# Altium project Carrier-Board-v1.0.PrjPcb (part 14 of 15)

## Sheet RGB_LEDs_INTERFACE.SchDoc
size A4; SheetNumber: 25; SheetTotal: 27
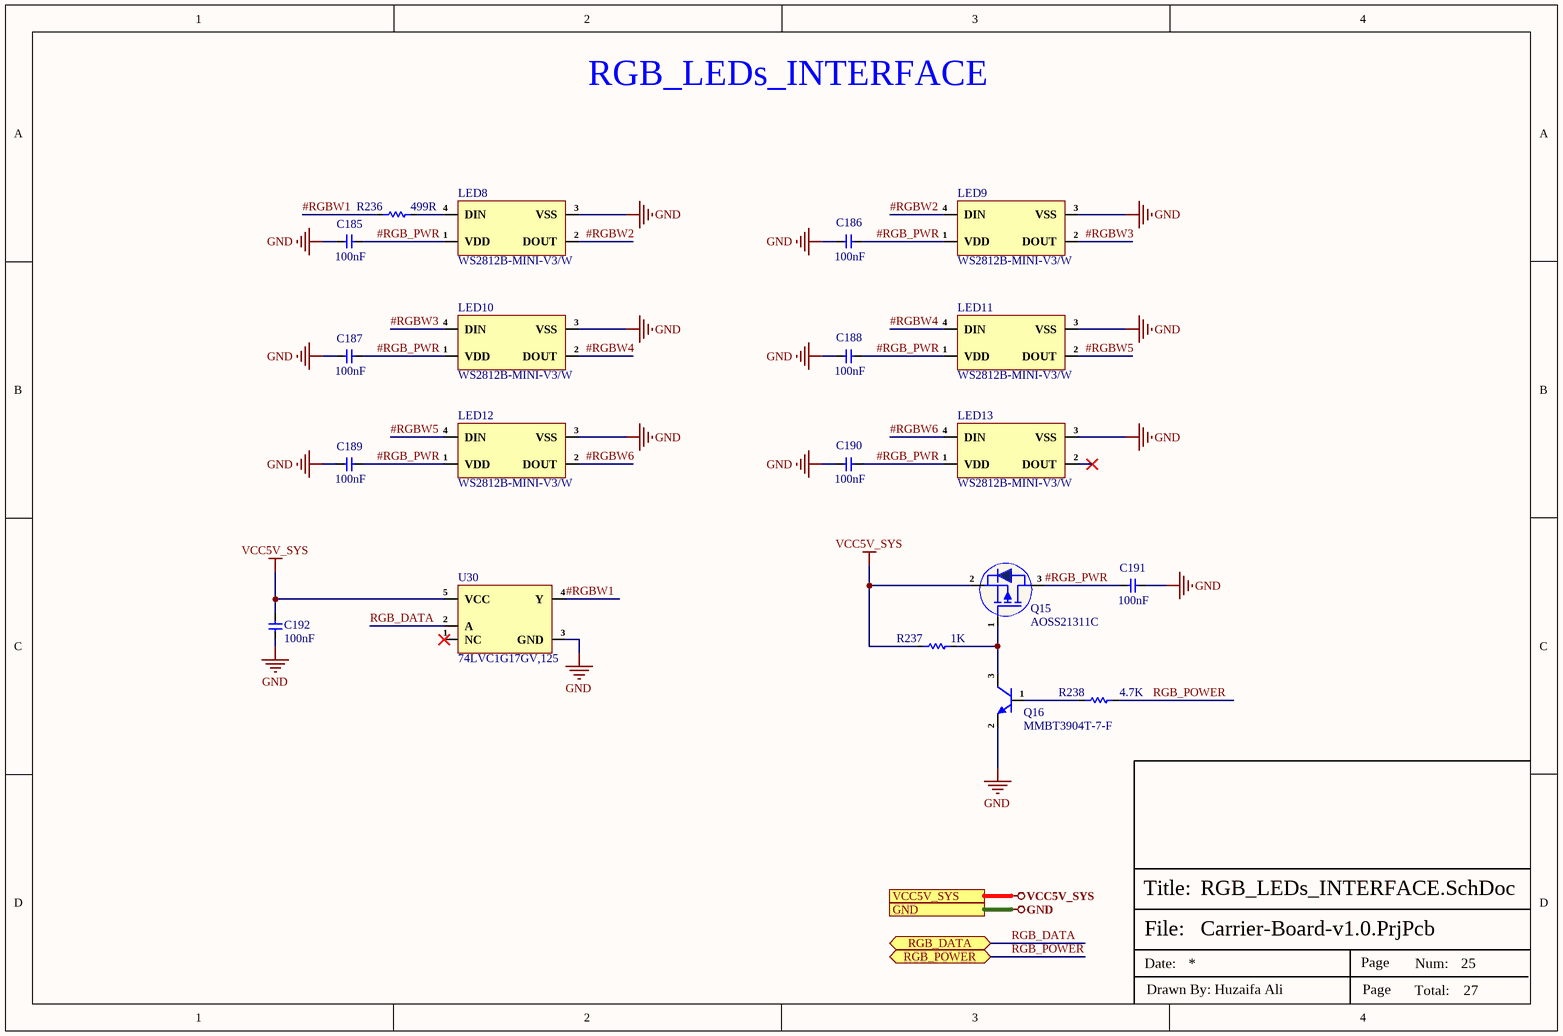
[diagram p23: RGB_LEDs_INTERFACE.SchDoc]

### Parts
C185  100nF  [Cap-0402]
C186  100nF  [Cap-0402]
C187  100nF  [Cap-0402]
C188  100nF  [Cap-0402]
C189  100nF  [Cap-0402]
C190  100nF  [Cap-0402]
C191  100nF  [Cap-0402]
C192  100nF  [Cap-0402]
LED8  WS2812B-MINI-V3/W  [SMD3535]
LED9  WS2812B-MINI-V3/W  [SMD3535]
LED10  WS2812B-MINI-V3/W  [SMD3535]
LED11  WS2812B-MINI-V3/W  [SMD3535]
LED12  WS2812B-MINI-V3/W  [SMD3535]
LED13  WS2812B-MINI-V3/W  [SMD3535]
Q15  AOSS21311C  [SOT-23]
Q16  MMBT3904T-7-F  [SOT-523]
R236  499R  [Res-0402]
R237  1K  [Res-0402]
R238  4.7K  [Res-0402]
U30  74LVC1G17GV,125  [SC-74A]

### Ports
GND (see TOP SHEET[4C], AUDIO_INTERFACE[1D], BUCK REGULATOR[3D], DEBUG_UART_INTERFACE[3D], DIGITAL IO_RELAY_SHEET[5D], DUAL_SIM_INTERFACE[3D], ETHERNET_PHY0[4D], ETHERNET_PHY1[4D], GSM_INTERFACE[2D], HDMI_INTERFACE[3D], INPUT_PROTECTION[3D], LINEAR_VOLTAGE_REG[3D], MICRO_SD_INTERFACE[3D], MIPI-DSI DISPLAY[3D], POWER SECTION[3D], PUSH BUTTONs_INTERFACE[3C], ROCKCHIP_PWR_SUPPLY[1D], ROCKCHIP_SYSTEM_CONTROL[3C], RS232_RS485_INTERFACE[3C], SENSOR_SHEET[3D], USB2.0_INTERFACE[3D], USB3.0_INTERFACE[3D], USB-C_INTERFACE[2D], WIEGAND_INTERFACE[3D], WIFI_BLUETOOTH_SHEET[4C]), RGB_DATA (bidir, see TOP SHEET[5C], ROCKCHIP_GPIO_NC PINS[2D]), RGB_POWER (bidir, see TOP SHEET[5C], ROCKCHIP_GPIO_NC PINS[2D]), VCC5V_SYS (see TOP SHEET[4C], BUCK REGULATOR[3D], DIGITAL IO_RELAY_SHEET[5D], HDMI_INTERFACE[3D], LINEAR_VOLTAGE_REG[3D], MIPI-DSI DISPLAY[3D], POWER SECTION[3D], ROCKCHIP_PWR_SUPPLY[1D], USB2.0_INTERFACE[3D], USB3.0_INTERFACE[3D], USB-C_INTERFACE[2D], WIEGAND_INTERFACE[3D])

### Nets
GND: C185.1 C186.1 C187.1 C188.1 C189.1 C190.1 C191.1 C192.1 LED8.3(VSS) LED9.3(VSS) LED10.3(VSS) LED11.3(VSS) LED12.3(VSS) LED13.3(VSS) Q16.2(E) U30.3(GND) ; port GND
VCC5V_SYS: C192.2 Q15.2(S) R237.1 U30.5(VCC) ; port VCC5V_SYS
#RGB_PWR: C185.2 C186.2 C187.2 C188.2 C189.2 C190.2 C191.2 LED8.1(VDD) LED9.1(VDD) LED10.1(VDD) LED11.1(VDD) LED12.1(VDD) LED13.1(VDD) Q15.3(D)
#RGBW1: R236.1 U30.4(Y)
#RGBW2: LED8.2(DOUT) LED9.4(DIN)
#RGBW3: LED9.2(DOUT) LED10.4(DIN)
#RGBW4: LED10.2(DOUT) LED11.4(DIN)
#RGBW5: LED11.2(DOUT) LED12.4(DIN)
#RGBW6: LED12.2(DOUT) LED13.4(DIN)
RGB_DATA: U30.2(A) ; port RGB_DATA
RGB_POWER: R238.2 ; port RGB_POWER
NetLED8_4: LED8.4(DIN) R236.2
NetQ15_1: Q15.1(G) Q16.3(C) R237.2
NetQ16_1: Q16.1(B) R238.1

Not connected (* = marked no-connect by the designer): LED13 2(DOUT)*; U30 1(NC)*

### Notes on the sheet
- RGB_LEDs_INTERFACE
- File:
- Title:
- Date:
- Page
- Num:
- Total:
- Drawn By: Huzaifa Ali

### Library data of the parts
C185-C192 = CC0402KRX5R7BB104: as C55 on sheet GSM_INTERFACE; Manufacturer Part Number: CC0402KRX5R7BB104; RoHS: Yes; Category: Ceramic Capacitors; Supplier 1: Mouser; Stock 1: 936792; Pricing 1: 1=0.10000, 10=0.02300, 50=0.02300, 100=0.01100, 1000=0.00600, 10000=0.00400 (USD); Mount: Surface Mount; Case/Package: 0402; Number of Pins: 2; Case Code (Metric): 1005; Case Code (Imperial): 0402; Min Operating Temperature: -55°C; Max Operating Temperature: 85°C; Capacitance: 100nF; Dielectric: X5R; Packaging: Tape and Reel; Voltage Rating: 16V; Package Quantity: 1; Voltage Rating (DC): 16V; Termination: SMD/SMT; Resistor Type: Ceramic; Series: CC; Construction: Flat; Length: 1mm; Width: 0.02inch; Height: 0.5mm; Thickness: 0.022inch; Depth: 0.5mm; Radiation Hardening: No; REACH SVHC: Unknown; Lead Free: Lead Free; Halogen Free: Halogen Free; RoHS Compliant: Yes; ComponentLink1URL: https://datasheet.ciiva.com/155/mlccorderingcode-155879.pdf?src-supplier=Digi-Key; ComponentLink1Description: https://datasheet.ciiva.com/155/mlccorderingcode-155879.pdf?src-supplier=Digi-Key; ComponentLink2URL: https://datasheet.ciiva.com/155/mlccorderingcode-155878.pdf?src-supplier=Digi-Key; ComponentLink2Description: https://datasheet.ciiva.com/155/mlccorderingcode-155878.pdf?src-supplier=Digi-Key; ComponentLink3URL: https://datasheet.ciiva.com/155/mlccorderingcode-155880.pdf?src-supplier=Digi-Key; ComponentLink3Description: https://datasheet.ciiva.com/155/mlccorderingcode-155880.pdf?src-supplier=Digi-Key; ComponentLink4URL: https://datasheet.ciiva.com/11464/upy-gphc-x5r-4v-to-50v-12-11464869.pdf?src-supplier=Avnet; ComponentLink4Description: https://datasheet.ciiva.com/11464/upy-gphc-x5r-4v-to-50v-12-11464869.pdf?src-supplier=Avnet; Supplier Part Number 1: 603-CC402KRX5R7BB104; LCSC Part Number: C106204
LED8-LED13 = WS2812B-MINI-V3/W: 12mA RGB SMD3535 Light Emitting Diodes (LED) ROHS; Manufacturer: Worldsemi; Item Type: RGB  LED; Manufacturer Part Number: WS2812B-MINI-V3/W; Package: SMD3535; LCSC Part Number: C527089; ComponentLink1Description: LCSC; ComponentLink1URL: https://www.lcsc.com/product-detail/Light-Emitting-Diodes-LED_Worldsemi-WS2812B-MINI-V3-W_C527089.html
Q15 = AOSS21311C: MOSFET P-CH 30V 4.3A SOT23-3; Manufacturer: Alpha & Omega Semiconductor; Supplier: Digikey; Supplier Part Number: 785-AOSS21311CCT-ND; Manufacturer Part Number: AOSS21311C; RoHS: Yes; Category: Transistors; Stock: 15013; Pricing: 1=0.44, 10=0.314, 100=0.1582, 500=0.14016, 1000=0.10908 (USD); LCSC Part Number: C3280149; Item Type: MOSFET
Q16 = MMBT3904T-7-F: TRANS NPN 40V 0.2A SOT523; Manufacturer: Diodes Zetex; Item Type: Transistor; Supplier: Future Electronics; Supplier Part Number: 4140292; Manufacturer Part Number: MMBT3904T-7-F; RoHS: Yes; Category: BJTs; Stock: 36000; Pricing: 3000=0.0261, 9000=0.0252, 15000=0.0248, 60000=0.0236, 90000=0.0229 (USD); ComponentLink1URL: https://datasheet.ciiva.com/15139/getdatasheetpartid-142850-15139485.pdf?src-supplier=Verical; ComponentLink1Description: https://datasheet.ciiva.com/15139/getdatasheetpartid-142850-15139485.pdf?src-supplier=Verical; ComponentLink2URL: https://datasheet.ciiva.com/11199/ds30270-11199009.pdf?src-supplier=Avnet; ComponentLink2Description: https://datasheet.ciiva.com/11199/ds30270-11199009.pdf?src-supplier=Avnet; ComponentLink3URL: https://datasheet.ciiva.com/17053/0900766b80e49818-17053736.pdf?src-supplier=Allied+Electronics; ComponentLink3Description: https://datasheet.ciiva.com/17053/0900766b80e49818-17053736.pdf?src-supplier=Allied+Electronics; ComponentLink4URL: https://datasheet.ciiva.com/8029/ds30270-8029717.pdf?src-supplier=Element14; ComponentLink4Description: https://datasheet.ciiva.com/8029/ds30270-8029717.pdf?src-supplier=Element14; ComponentLink5URL: https://datasheet.ciiva.com/22711/480146-22711751.pdf?src-supplier=Element14; ComponentLink5Description: https://datasheet.ciiva.com/22711/480146-22711751.pdf?src-supplier=Element14; ComponentLink6URL: https://datasheet.ciiva.com/4723/ds30270-4723401.pdf?src-supplier=Mouser; ComponentLink6Description: https://datasheet.ciiva.com/4723/ds30270-4723401.pdf?src-supplier=Mouser; ComponentLink7URL: https://datasheet.ciiva.com/6360/ds30270-6360919.pdf?src-supplier=Digikey; ComponentLink7Description: https://datasheet.ciiva.com/6360/ds30270-6360919.pdf?src-supplier=Digikey; LCSC Part Number: C239187
R236 = RC0402FR-07499RL: RES 499 OHM 1% 1/16W 0402; Manufacturer: Yageo; Power Rating: 62.5mW; Voltage Rating: 50V; Max Power Dissipation: 63mW; Temperature Coefficient: 100ppm/°C; Supplier 1: Mouser; Manufacturer Part Number: RC0402FR-07499RL; RoHS: Yes; Category: Chip SMD Resistors; Stock 1: 936879; Pricing 1: 1=0.10000, 10=0.01200, 50=0.01200, 100=0.00500, 1000=0.00300, 10000=0.00100 (USD); Case/Package: 0402; Case Code (Metric): 1005; Case Code (Imperial): 0402; Size Code: 0402; Min Operating Temperature: -55°C; Max Operating Temperature: 155°C; Resistance: 499R; Tolerance: 1%; Package Quantity: 1; Packaging: Tape and Reel; Resistor Type: Thick Film; Number of Terminations: 2; Termination: SMD/SMT; Voltage Rating (DC): 50V; Features: Moisture Resistant; Series: RC; Resistance Tolerance: 1%; Construction: Rectangular; Length: 1mm; Width: 0.02inch; Height: 0.016inch; Depth: 0.5mm; RoHS Compliant: Yes; REACH SVHC: No SVHC; Military Standard: Not; Lead Free: Lead Free; ComponentLink1URL: https://datasheet.ciiva.com/2453/pyu-r-int-thick-7-2453539.pdf?src-supplier=Digi-Key; ComponentLink1Description: https://datasheet.ciiva.com/2453/pyu-r-int-thick-7-2453539.pdf?src-supplier=Digi-Key; ComponentLink2URL: https://datasheet.ciiva.com/2453/pyu-r-int-thick-7-2453540.pdf?src-supplier=Digi-Key; ComponentLink2Description: https://datasheet.ciiva.com/2453/pyu-r-int-thick-7-2453540.pdf?src-supplier=Digi-Key; ComponentLink3URL: https://datasheet.ciiva.com/2453/pyu-r-int-thick-7-2453538.pdf?src-supplier=Digi-Key; ComponentLink3Description: https://datasheet.ciiva.com/2453/pyu-r-int-thick-7-2453538.pdf?src-supplier=Digi-Key; Supplier Part Number 1: 603-RC0402FR-07499RL; LCSC Part Number: C137970
R237 = RC0402FR-071KL: RES 1K OHM 1% 1/16W 0402; Manufacturer: Yageo; Resistance: 1kR; Temperature Coefficient: 100ppm/°C; Voltage Rating (DC): 50V; Power Rating: 62.5mW; Max Power Dissipation: 63mW; Item Type: Resistor; Supplier 1: Avnet; Manufacturer Part Number: RC0402FR-071KL; RoHS: Yes; Category: Chip SMD Resistors; Stock 1: 13030000; Pricing 1: 10000=0.00085, 20000=0.00087, 40000=0.00084, 60000=0.00083, 80000=0.00079, 100000=0.00078, 1000000=0.00076 (USD); Case/Package: 0402; Number of Pins: 2; Case Code (Imperial): 0402; Case Code (Metric): 1005; Size Code: 0402; Min Operating Temperature: -55°C; Max Operating Temperature: 155°C; Resistor Type: Thick Film; Tolerance: 1%; Packaging: Tape and Reel; Voltage Rating: 50V; Termination: SMD/SMT; Features: Moisture Resistant; Series: RC; Number of Terminations: 2; Resistance Tolerance: 1%; Construction: Rectangular; Technology: THICK FILM; Length: 1mm; Width: 0.5mm; Height: 0.32mm; Depth: 0.5mm; Reach SVHC Compliant: Yes; Lead Free: Lead Free; RoHS Compliant: Yes; Military Standard: Not; ComponentLink1URL: https://datasheet.ciiva.com/11819/0900766b80c66297-11819477.pdf?src-supplier=RSComponents; ComponentLink1Description: https://datasheet.ciiva.com/11819/0900766b80c66297-11819477.pdf?src-supplier=RSComponents; ComponentLink2URL: https://datasheet.ciiva.com/7983/1018594-7983502.pdf?src-supplier=Element14; ComponentLink2Description: https://datasheet.ciiva.com/7983/1018594-7983502.pdf?src-supplier=Element14; ComponentLink3URL: https://datasheet.ciiva.com/22747/1018594-22747513.pdf?src-supplier=Element14; ComponentLink3Description: https://datasheet.ciiva.com/22747/1018594-22747513.pdf?src-supplier=Element14; ComponentLink4URL: https://datasheet.ciiva.com/12666/pyu-rc0402-51-rohs-l-6-r-12666741.pdf?src-supplier=Mouser; ComponentLink4Description: https://datasheet.ciiva.com/12666/pyu-rc0402-51-rohs-l-6-r-12666741.pdf?src-supplier=Mouser; ComponentLink5URL: https://datasheet.ciiva.com/7849/1018594-7849869.pdf?src-supplier=Element14; ComponentLink5Description: https://datasheet.ciiva.com/7849/1018594-7849869.pdf?src-supplier=Element14; ComponentLink6URL: https://datasheet.ciiva.com/7849/1018594-7849871.pdf?src-supplier=Element14; ComponentLink6Description: https://datasheet.ciiva.com/7849/1018594-7849871.pdf?src-supplier=Element14; ComponentLink7URL: https://datasheet.ciiva.com/17063/pyu-rc0402-51-rohs-l-6-r-17063193.pdf?src-supplier=Future+Electronics; ComponentLink7Description: https://datasheet.ciiva.com/17063/pyu-rc0402-51-rohs-l-6-r-17063193.pdf?src-supplier=Future+Electronics; Supplier Part Number 1: RC0402FR-071KL; LCSC Part Number: C106235
R238 = RC0402FR-074K7L: RES 4.7K OHM 1% 1/16W 0402; Manufacturer: Yageo; Voltage Rating (DC): 50V; Power Rating: 62.5mW; Resistance: 4.7kR; Temperature Coefficient: 100ppm/°C; Max Power Dissipation: 63mW; Item Type: Resistor; Supplier 1: Avnet; Manufacturer Part Number: RC0402FR-074K7L; RoHS: Yes; Category: Chip SMD Resistors; Stock 1: 2420000; Pricing 1: 10000=0.00085 (USD); Case/Package: 0402; Number of Pins: 2; Case Code (Imperial): 0402; Case Code (Metric): 1005; Size Code: 0402; Min Operating Temperature: -55°C; Max Operating Temperature: 155°C; Tolerance: 1%; Voltage Rating: 50V; Packaging: Tape and Reel; Resistor Type: Thick Film; Termination: SMD/SMT; Features: Moisture Resistant; Series: RC; Number of Terminations: 2; Resistance Tolerance: 1%; Construction: Rectangular; Length: 1mm; Width: 0.5mm; Height: 0.32mm; Depth: 0.5mm; Height - Seated (Max): 0.016inch; RoHS Compliant: Yes; Reach SVHC Compliant: Yes; Military Standard: Not; Lead Free: Lead Free; ComponentLink1URL: https://datasheet.ciiva.com/22661/1686128-22661342.pdf?src-supplier=Element14; ComponentLink1Description: https://datasheet.ciiva.com/22661/1686128-22661342.pdf?src-supplier=Element14; ComponentLink2URL: https://datasheet.ciiva.com/7850/1018594-7850022.pdf?src-supplier=Element14; ComponentLink2Description: https://datasheet.ciiva.com/7850/1018594-7850022.pdf?src-supplier=Element14; ComponentLink3URL: https://datasheet.ciiva.com/7850/1018594-7850023.pdf?src-supplier=Element14; ComponentLink3Description: https://datasheet.ciiva.com/7850/1018594-7850023.pdf?src-supplier=Element14; ComponentLink4URL: https://datasheet.ciiva.com/15215/getdatasheetpartid-328119-15215035.pdf?src-supplier=Verical; ComponentLink4Description: https://datasheet.ciiva.com/15215/getdatasheetpartid-328119-15215035.pdf?src-supplier=Verical; Supplier Part Number 1: RC0402FR-074K7L; LCSC Part Number: C105871
U30 = 74LVC1G17GV,125: IC BUFFER SCHMITT TRIGGER 5TSOP; Manufacturer: Nexperia; Number of Channels: 1NUMBER; Supplier: Future Electronics; Supplier Part Number: 9876707; Manufacturer Part Number: 74LVC1G17GV,125; RoHS: Yes; Category: Logic Gates; Stock: 513000; Pricing: 3000=0.0334, 9000=0.0322, 30000=0.031, 60000=0.0303, 120000=0.029 (USD); Pins: 5NUMBER; Packaging: 10Packaging; RoHS Compliant: Yes; ComponentLink1URL: http://www.farnell.com/datasheets/2185283.pdf?src-supplier=Farnell; ComponentLink1Description: http://www.farnell.com/datasheets/2185283.pdf?src-supplier=Farnell; ComponentLink2URL: https://datasheet.octopart.com/74LVC1G17GV%2C125-Nexperia-datasheet-11799833.pdf?src-supplier=Farnell; ComponentLink2Description: https://datasheet.octopart.com/74LVC1G17GV%2C125-Nexperia-datasheet-11799833.pdf?src-supplier=Farnell; ComponentLink3URL: https://assets.nexperia.com/documents/data-sheet/74LVC1G17.pdf?src-supplier=Digikey; ComponentLink3Description: https://assets.nexperia.com/documents/data-sheet/74LVC1G17.pdf?src-supplier=Digikey; ComponentLink4URL: https://datasheet.octopart.com/74LVC1G17GV%2C125-Nexperia-datasheet-116120530.pdf?src-supplier=Future+Electronics; ComponentLink4Description: https://datasheet.octopart.com/74LVC1G17GV%2C125-Nexperia-datasheet-116120530.pdf?src-supplier=Future+Electronics; ComponentLink5URL: https://datasheet.octopart.com/74LVC1G17GV%2C125-Nexperia-datasheet-73818103.pdf?src-supplier=Element14; ComponentLink5Description: https://datasheet.octopart.com/74LVC1G17GV%2C125-Nexperia-datasheet-73818103.pdf?src-supplier=Element14; ComponentLink6URL: https://datasheet.octopart.com/74LVC1G17GV%2C125-NXP-Semiconductors-datasheet-13026859.pdf?src-supplier=Newark; ComponentLink6Description: https://datasheet.octopart.com/74LVC1G17GV%2C125-NXP-Semiconductors-datasheet-13026859.pdf?src-supplier=Newark; LCSC Part Number: C6076; Item Type: IC

## Sheet PUSH BUTTONs_INTERFACE.SchDoc
size A4; SheetNumber: 24; SheetTotal: 27
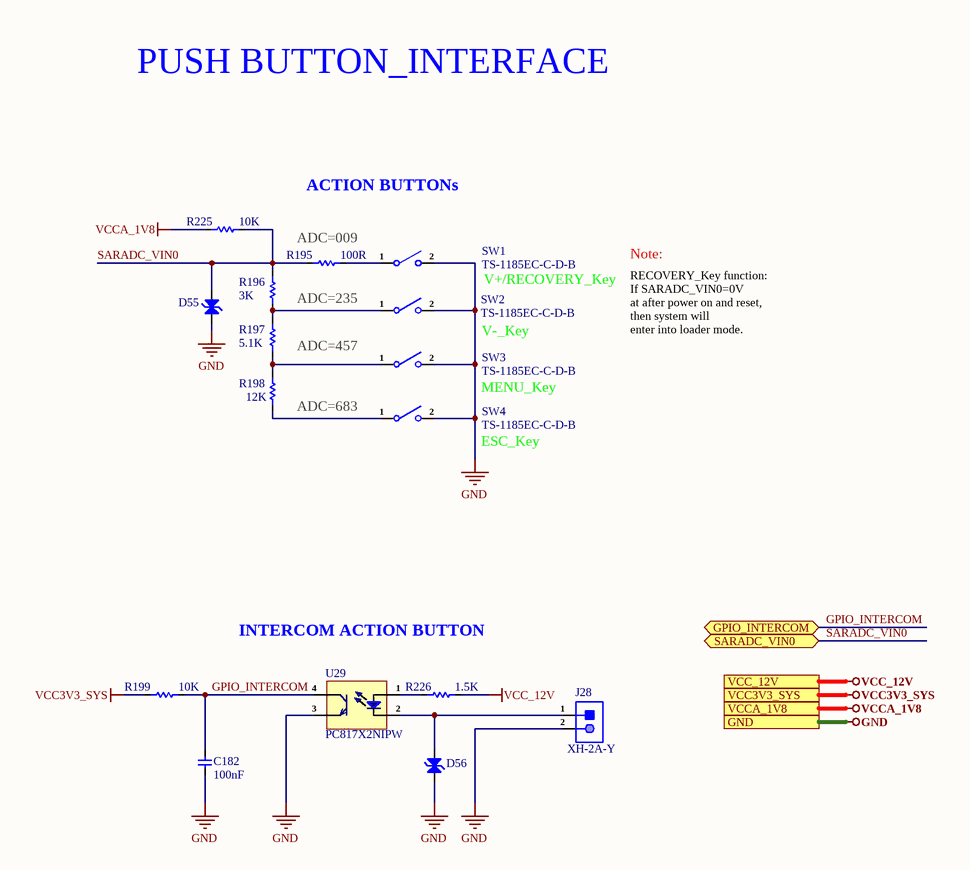
[diagram p24: PUSH BUTTONs_INTERFACE.SchDoc]

### Parts
C182  100nF  [Cap-0402]
D55  ESD5451N  [DFN1006-2L (Bi-Directional)]  (value not drawn)
D56  ESD5451N  [DFN1006-2L (Bi-Directional)]  (value not drawn)
J28  XH-2A-Y  [XH-2A-Y]
R195  100R  [Res-0402]
R196  3K  [Res-0402]
R197  5.1K  [Res-0402]
R198  12K  [Res-0402]
R199  10K  [Res-0402]
R225  10K  [Res-0402]
R226  1.5K  [Res-0402]
SW1  TS-1185EC-C-D-B  [TS-1185EC-C-D-B_]
SW2  TS-1185EC-C-D-B  [TS-1185EC-C-D-B_]
SW3  TS-1185EC-C-D-B  [TS-1185EC-C-D-B_]
SW4  TS-1185EC-C-D-B  [TS-1185EC-C-D-B_]
U29  PC817X2NIPW  [PC817X2NIPW]

### Ports
GND (see TOP SHEET[4D], AUDIO_INTERFACE[1D], BUCK REGULATOR[3D], DEBUG_UART_INTERFACE[3D], DIGITAL IO_RELAY_SHEET[5D], DUAL_SIM_INTERFACE[3D], ETHERNET_PHY0[4D], ETHERNET_PHY1[4D], GSM_INTERFACE[2D], HDMI_INTERFACE[3D], INPUT_PROTECTION[3D], LINEAR_VOLTAGE_REG[3D], MICRO_SD_INTERFACE[3D], MIPI-DSI DISPLAY[3D], POWER SECTION[3D], RGB_LEDs_INTERFACE[3D], ROCKCHIP_PWR_SUPPLY[1D], ROCKCHIP_SYSTEM_CONTROL[3C], RS232_RS485_INTERFACE[3C], SENSOR_SHEET[3D], USB2.0_INTERFACE[3D], USB3.0_INTERFACE[3D], USB-C_INTERFACE[2D], WIEGAND_INTERFACE[3D], WIFI_BLUETOOTH_SHEET[4C]), GPIO_INTERCOM (bidir, see TOP SHEET[5D], ROCKCHIP_GPIO_NC PINS[3D]), SARADC_VIN0 (bidir, see TOP SHEET[5D], ROCKCHIP_GPIO_NC PINS[3C]), VCC3V3_SYS (see TOP SHEET[4D], AUDIO_INTERFACE[1D], BUCK REGULATOR[3D], DEBUG_UART_INTERFACE[3D], DIGITAL IO_RELAY_SHEET[5D], ETHERNET_PHY0[4D], ETHERNET_PHY1[4D], GSM_INTERFACE[2D], HDMI_INTERFACE[3D], LINEAR_VOLTAGE_REG[3D], MIPI-DSI DISPLAY[3D], POWER SECTION[3D], ROCKCHIP_PWR_SUPPLY[1D], ROCKCHIP_SYSTEM_CONTROL[3C], RS232_RS485_INTERFACE[3C], SENSOR_SHEET[3D], USB-C_INTERFACE[2D], WIEGAND_INTERFACE[3D], WIFI_BLUETOOTH_SHEET[4C]), VCC_12V (see TOP SHEET[4D], AUDIO_INTERFACE[1D], BUCK REGULATOR[3D], INPUT_PROTECTION[3D], POWER SECTION[3D], WIEGAND_INTERFACE[3D]), VCCA_1V8 (see TOP SHEET[4D], ROCKCHIP_PWR_SUPPLY[1D], ROCKCHIP_SYSTEM_CONTROL[3C])

### Nets
GND: C182.1 D55.1(K) D56.1(K) J28.2 SW1.2 SW2.2 SW3.2 SW4.2 U29.3(E) ; port GND
VCC3V3_SYS: R199.2 ; port VCC3V3_SYS
VCC_12V: R226.2 ; port VCC_12V
VCCA_1V8: R225.2 ; port VCCA_1V8
GPIO_INTERCOM: C182.2 R199.1 U29.4(C) ; port GPIO_INTERCOM
SARADC_VIN0: D55.2(K) R195.1 R196.2 R225.1 ; port SARADC_VIN0
NetD56_2: D56.2(K) J28.1 U29.2(Ca)
NetR195_2: R195.2 SW1.1
NetR196_1: R196.1 R197.2 SW2.1
NetR197_1: R197.1 R198.2 SW3.1
NetR198_1: R198.1 SW4.1
NetR226_1: R226.1 U29.1(An)

### Notes on the sheet
- PUSH BUTTON_INTERFACE
- ACTION BUTTONs
- (near R195) ADC=009
- ADC=235
- V+/RECOVERY_Key
- Note:
- ADC=457
- V-_Key
- RECOVERY_Key function:
  If SARADC_VIN0=0V
  at after power on and reset,
  then system will
  enter into loader mode.
- ADC=683
- ESC_Key
- MENU_Key
- INTERCOM ACTION BUTTON
- File:
- Title:
- Date:
- Page
- Num:
- Total:
- Drawn By: Huzaifa Ali

### Library data of the parts
C182 = CC0402KRX5R7BB104: CAP CER 0.1UF 16V X5R 0402; Manufacturer: Yageo; Tolerance: 10%; Manufacturer Part Number: CC0402KRX5R7BB104; RoHS: Yes; Category: Ceramic Capacitors; Supplier 1: Mouser; Stock 1: 936792; Pricing 1: 1=0.10000, 10=0.02300, 50=0.02300, 100=0.01100, 1000=0.00600, 10000=0.00400 (USD); Mount: Surface Mount; Case/Package: 0402; Number of Pins: 2; Case Code (Metric): 1005; Case Code (Imperial): 0402; Min Operating Temperature: -55°C; Max Operating Temperature: 85°C; Capacitance: 100nF; Dielectric: X5R; Packaging: Tape and Reel; Voltage Rating: 16V; Package Quantity: 1; Voltage Rating (DC): 16V; Termination: SMD/SMT; Resistor Type: Ceramic; Series: CC; Construction: Flat; Length: 1mm; Width: 0.02inch; Height: 0.5mm; Thickness: 0.022inch; Depth: 0.5mm; Radiation Hardening: No; REACH SVHC: Unknown; Lead Free: Lead Free; Halogen Free: Halogen Free; RoHS Compliant: Yes; ComponentLink1URL: https://datasheet.ciiva.com/155/mlccorderingcode-155879.pdf?src-supplier=Digi-Key; ComponentLink1Description: https://datasheet.ciiva.com/155/mlccorderingcode-155879.pdf?src-supplier=Digi-Key; ComponentLink2URL: https://datasheet.ciiva.com/155/mlccorderingcode-155878.pdf?src-supplier=Digi-Key; ComponentLink2Description: https://datasheet.ciiva.com/155/mlccorderingcode-155878.pdf?src-supplier=Digi-Key; ComponentLink3URL: https://datasheet.ciiva.com/155/mlccorderingcode-155880.pdf?src-supplier=Digi-Key; ComponentLink3Description: https://datasheet.ciiva.com/155/mlccorderingcode-155880.pdf?src-supplier=Digi-Key; ComponentLink4URL: https://datasheet.ciiva.com/11464/upy-gphc-x5r-4v-to-50v-12-11464869.pdf?src-supplier=Avnet; ComponentLink4Description: https://datasheet.ciiva.com/11464/upy-gphc-x5r-4v-to-50v-12-11464869.pdf?src-supplier=Avnet; Supplier Part Number 1: 603-CC402KRX5R7BB104; LCSC Part Number: C106204
D55 D56 = ESD5451N: DFN1006-2(0402) ESD Protection Devices ROHS; Manufacturer: TECH PUBLIC; Manufacturer Part Number: ESD5451N; Footprint: DFN1006-2(0402); ComponentLink1Description: LCSC; ComponentLink1URL: https://www.lcsc.com/product-detail/span-style-background-color-ff0-ESD-span-Protection-Devices_TECH-PUBLIC-ESD5451N_C2936977.html; LCSC Part Number: C2936977
J28 = XH-2A-Y: 1x2P 2P XH 1 Tin 2.5mm 2 -25℃~+85℃ Brass 3A Straight Plugin,P=2.5mm Wire To Board Connector ROHS; Manufacturer: HCTL; Manufacturer Part Number: XH-2A-Y; Package: Plugin,P=2.5mm; LCSC Part Number: C2908595; Item Type: Wire To Board Connector; ComponentLink1Description: LCSC; ComponentLink1URL: https://www.lcsc.com/product-detail/Wire-To-Board-Connector_HCTL-XH-2A-Y_C2908595.html
R195 = RC0402FR-07100RL: RES 100 OHM 1% 1/16W 0402; Manufacturer: Yageo; Power Rating: 62.5mW; Voltage Rating: 50V; Temperature Coefficient: 100ppm/°C; Max Power Dissipation: 63mW; Item Type: Resistor; Supplier 1: Mouser; Manufacturer Part Number: RC0402FR-07100RL; RoHS: Yes; Category: Chip SMD Resistors; Stock 1: 699545; Pricing 1: 1=0.10000, 10=0.01200, 50=0.01200, 100=0.00500, 1000=0.00300, 2500=0.00200, 10000=0.00100 (USD); Case/Package: 0402; Number of Pins: 2; Case Code (Imperial): 0402; Case Code (Metric): 1005; Size Code: 0402; Min Operating Temperature: -55°C; Max Operating Temperature: 155°C; Tolerance: 1%; Voltage Rating (DC): 50V; Resistance: 100R; Packaging: Tape and Reel; Termination: SMD/SMT; Resistor Type: Thick Film; Features: Moisture Resistant; Series: RC; Number of Terminations: 2; Resistance Tolerance: 1%; Construction: Rectangular; Technology: THICK FILM; Length: 1mm; Width: 0.5mm; Height: 0.32mm; Depth: 0.5mm; RoHS Compliant: Yes; REACH SVHC: No SVHC; Military Standard: Not; Lead Free: Lead Free; ComponentLink1URL: https://datasheet.ciiva.com/11808/0900766b80c66297-11808765.pdf?src-supplier=RSComponents; ComponentLink1Description: https://datasheet.ciiva.com/11808/0900766b80c66297-11808765.pdf?src-supplier=RSComponents; ComponentLink2URL: https://datasheet.ciiva.com/7849/1784430-7849810.pdf?src-supplier=Element14; ComponentLink2Description: https://datasheet.ciiva.com/7849/1784430-7849810.pdf?src-supplier=Element14; ComponentLink3URL: https://datasheet.ciiva.com/28367/1018594-28367226.pdf?src-supplier=Element14; ComponentLink3Description: https://datasheet.ciiva.com/28367/1018594-28367226.pdf?src-supplier=Element14; ComponentLink4URL: https://datasheet.ciiva.com/22747/1018594-22747511.pdf?src-supplier=Element14; ComponentLink4Description: https://datasheet.ciiva.com/22747/1018594-22747511.pdf?src-supplier=Element14; ComponentLink5URL: https://datasheet.ciiva.com/12667/pyu-rc0402-51-rohs-l-6-r-12667957.pdf?src-supplier=Mouser; ComponentLink5Description: https://datasheet.ciiva.com/12667/pyu-rc0402-51-rohs-l-6-r-12667957.pdf?src-supplier=Mouser; ComponentLink6URL: https://datasheet.ciiva.com/15189/getdatasheetpartid-329466-15189335.pdf?src-supplier=Verical; ComponentLink6Description: https://datasheet.ciiva.com/15189/getdatasheetpartid-329466-15189335.pdf?src-supplier=Verical; ComponentLink7URL: https://datasheet.ciiva.com/16740/pyu-rc0402-51-rohs-l-6-r-16740566.pdf?src-supplier=Future+Electronics; ComponentLink7Description: https://datasheet.ciiva.com/16740/pyu-rc0402-51-rohs-l-6-r-16740566.pdf?src-supplier=Future+Electronics; Supplier Part Number 1: 603-RC0402FR-07100RL; LCSC Part Number: C106232
R196 = RC0402FR-073KL: RES 3K OHM 1% 1/16W 0402; Manufacturer: Yageo; Value: 3kR; Power Rating: 63mW; Voltage Rating: 50V; Temperature Coefficient: 100ppm/°C; Item Type: Resistor; Supplier: Digikey; Supplier Part Number: 311-3KLRCT-ND; Manufacturer Part Number: RC0402FR-073KL; RoHS: Yes; Category: Chip SMD Resistors; Stock: 7013; Pricing: 1=0.1, 10=0.015, 50=0.0088, 100=0.0073, 500=0.00488, 1000=0.00417, 5000=0.00297 (USD); Case/Package: 0402; Case Code (Metric): 1005; Case Code (Imperial): 0402; Min Operating Temperature: -55°C; Max Operating Temperature: 155°C; Tolerance: 1%; Package Quantity: 1; Packaging: Tape and Reel; Resistor Type: Thick Film; Number of Terminations: 2; Termination: SMD/SMT; Max Power Dissipation: 63mW; Features: Moisture Resistant; Series: RC; Resistance Tolerance: 1%; Construction: Rectangular; Voltage Rating (DC): 50V; Length: 0.039inch; Width: 0.02inch; Height: 0.016inch; Depth: 0.5mm; Military Standard: Not; RoHS Compliant: Yes; Reach SVHC Compliant: Unknown; Lead Free: 5697LeadFree; ComponentLink1URL: https://datasheet.ciiva.com/2553/pyu-r-int-thick-7-2553254.pdf?src-supplier=Digikey; ComponentLink1Description: https://datasheet.ciiva.com/2553/pyu-r-int-thick-7-2553254.pdf?src-supplier=Digikey; ComponentLink2URL: https://datasheet.ciiva.com/7849/1018594-7849992.pdf?src-supplier=Element14; ComponentLink2Description: https://datasheet.ciiva.com/7849/1018594-7849992.pdf?src-supplier=Element14; ComponentLink3URL: https://datasheet.ciiva.com/7849/1018594-7849991.pdf?src-supplier=Element14; ComponentLink3Description: https://datasheet.ciiva.com/7849/1018594-7849991.pdf?src-supplier=Element14; ComponentLink4URL: https://datasheet.ciiva.com/2553/pyu-r-int-thick-7-2553255.pdf?src-supplier=Digikey; ComponentLink4Description: https://datasheet.ciiva.com/2553/pyu-r-int-thick-7-2553255.pdf?src-supplier=Digikey; ComponentLink5URL: https://datasheet.ciiva.com/2553/pyu-r-int-thick-7-2553256.pdf?src-supplier=Digikey; ComponentLink5Description: https://datasheet.ciiva.com/2553/pyu-r-int-thick-7-2553256.pdf?src-supplier=Digikey; ComponentLink6URL: https://datasheet.ciiva.com/12666/pyu-rc0402-51-rohs-l-6-r-12666952.pdf?src-supplier=Mouser; ComponentLink6Description: https://datasheet.ciiva.com/12666/pyu-rc0402-51-rohs-l-6-r-12666952.pdf?src-supplier=Mouser; LCSC Part Number: C137987
R197 = RC0402FR-075K1L: RES 5.1K OHM 1% 1/16W 0402; Manufacturer: Yageo; Power Rating: 63mW; Resistance: 5.1kR; Temperature Coefficient: 100ppm/°C; Voltage Rating: 50V; Item Type: Resistor; Supplier 1: Avnet; Manufacturer Part Number: RC0402FR-075K1L; RoHS: Yes; Category: Chip SMD Resistors; Stock 1: 65000; Pricing 1: 10000=0.00085 (USD); Case/Package: 0402; Case Code (Metric): 1005; Case Code (Imperial): 0402; Min Operating Temperature: -55°C; Max Operating Temperature: 155°C; Tolerance: 1%; Technology: THICK FILM; Packaging: Tape and Reel; Package Quantity: 1; Resistor Type: Thick Film; Number of Terminations: 2; Termination: SMD/SMT; Max Power Dissipation: 63mW; Voltage Rating (DC): 50V; Working Voltage: 50V; Features: Moisture Resistant; Series: RC; Resistance Tolerance: 1%; Construction: Rectangular; Length: 1mm; Width: 0.02inch; Height: 0.016inch; Depth: 0.5mm; RoHS Compliant: Yes; Military Standard: Not; Lead Free: Lead Free; ComponentLink1URL: https://datasheet.ciiva.com/7983/1018594-7983519.pdf?src-supplier=Element14; ComponentLink1Description: https://datasheet.ciiva.com/7983/1018594-7983519.pdf?src-supplier=Element14; ComponentLink2URL: https://datasheet.ciiva.com/46394/1018594-46394936.pdf?src-supplier=Element14; ComponentLink2Description: https://datasheet.ciiva.com/46394/1018594-46394936.pdf?src-supplier=Element14; ComponentLink3URL: https://datasheet.ciiva.com/2453/pyu-r-int-thick-7-2453401.pdf?src-supplier=Digi-Key; ComponentLink3Description: https://datasheet.ciiva.com/2453/pyu-r-int-thick-7-2453401.pdf?src-supplier=Digi-Key; ComponentLink4URL: https://datasheet.ciiva.com/2453/pyu-r-int-thick-7-2453402.pdf?src-supplier=Digi-Key; ComponentLink4Description: https://datasheet.ciiva.com/2453/pyu-r-int-thick-7-2453402.pdf?src-supplier=Digi-Key; ComponentLink5URL: https://datasheet.ciiva.com/2453/pyu-r-int-thick-7-2453400.pdf?src-supplier=Digi-Key; ComponentLink5Description: https://datasheet.ciiva.com/2453/pyu-r-int-thick-7-2453400.pdf?src-supplier=Digi-Key; ComponentLink6URL: https://datasheet.ciiva.com/12558/pyu-rc0402-51-rohs-l-6-r-8721-12558460.pdf?src-supplier=Mouser; ComponentLink6Description: https://datasheet.ciiva.com/12558/pyu-rc0402-51-rohs-l-6-r-8721-12558460.pdf?src-supplier=Mouser; ComponentLink7URL: https://datasheet.ciiva.com/16744/pyu-rc0402-51-rohs-l-6-r-16744283.pdf?src-supplier=Future+Electronics; ComponentLink7Description: https://datasheet.ciiva.com/16744/pyu-rc0402-51-rohs-l-6-r-16744283.pdf?src-supplier=Future+Electronics; ComponentLink8URL: https://datasheet.ciiva.com/15189/getdatasheetpartid-323636-15189493.pdf?src-supplier=Verical; ComponentLink8Description: https://datasheet.ciiva.com/15189/getdatasheetpartid-323636-15189493.pdf?src-supplier=Verical; Supplier Part Number 1: RC0402FR-075K1L; LCSC Part Number: C105872
R198 = RC0402FR-0712KL: RES 12K OHM 1% 1/16W 0402; Manufacturer: Yageo; Temperature Coefficient: 100ppm/°C; Max Power Dissipation: 63mW; Value: 12kR; Power Rating: 62.5mW; Voltage Rating: 50V; Manufacturer Part Number: RC0402FR-0712KL; Case/Package: 0402; Min Operating Temperature: -55°C; Max Operating Temperature: 155°C; Tolerance: 1%; Packaging: Tape and Reel; Resistor Type: Thick Film; Number of Terminations: 2; Features: Moisture Resistant; Length: 1mm; Width: 0.02inch; ComponentLink1URL: https://datasheet.ciiva.com/46412/1018594-46412831.pdf?src-supplier=Element14; ComponentLink1Description: https://datasheet.ciiva.com/46412/1018594-46412831.pdf?src-supplier=Element14; ComponentLink2URL: https://datasheet.ciiva.com/2453/pyu-r-int-thick-7-2453380.pdf?src-supplier=Digikey; ComponentLink2Description: https://datasheet.ciiva.com/2453/pyu-r-int-thick-7-2453380.pdf?src-supplier=Digikey; ComponentLink3URL: https://datasheet.ciiva.com/2453/pyu-r-int-thick-7-2453381.pdf?src-supplier=Digikey; ComponentLink3Description: https://datasheet.ciiva.com/2453/pyu-r-int-thick-7-2453381.pdf?src-supplier=Digikey; Package Quantity: 1; Height: 0.016inch; Supplier: Future Electronics; Supplier Part Number: 5655139; RoHS: Yes; Category: Chip SMD Resistors; Stock: 2030000; Pricing: 10000=0.0011, 100000=0.0011, 300000=0.001, 750000=0.001, 2000000=0.0009 (USD); Case Code (Metric): 1005; Case Code (Imperial): 0402; Weight: 2.3E-05oz; Termination: SMD/SMT; Series: RC; Resistance Tolerance: 1%; Construction: Rectangular; Voltage Rating (AC): 50V; Depth: 0.5mm; Reach SVHC Compliant: No; Military Standard: Not; RoHS Compliant: Yes; Lead Free: 5697LeadFree; ComponentLink4URL: https://datasheet.ciiva.com/2453/pyu-r-int-thick-7-2453379.pdf?src-supplier=Digikey; ComponentLink4Description: https://datasheet.ciiva.com/2453/pyu-r-int-thick-7-2453379.pdf?src-supplier=Digikey; ComponentLink5URL: https://datasheet.ciiva.com/12577/pyu-rc0402-51-rohs-l-6-r-12577269.pdf?src-supplier=Mouser; ComponentLink5Description: https://datasheet.ciiva.com/12577/pyu-rc0402-51-rohs-l-6-r-12577269.pdf?src-supplier=Mouser; ComponentLink6URL: https://datasheet.ciiva.com/7849/1018594-7849833.pdf?src-supplier=Element14; ComponentLink6Description: https://datasheet.ciiva.com/7849/1018594-7849833.pdf?src-supplier=Element14; ComponentLink7URL: https://datasheet.ciiva.com/7849/1018594-7849832.pdf?src-supplier=Element14; ComponentLink7Description: https://datasheet.ciiva.com/7849/1018594-7849832.pdf?src-supplier=Element14; ComponentLink8URL: https://datasheet.ciiva.com/16744/pyu-rc0402-51-rohs-l-6-r-16744492.pdf?src-supplier=Future+Electronics; ComponentLink8Description: https://datasheet.ciiva.com/16744/pyu-rc0402-51-rohs-l-6-r-16744492.pdf?src-supplier=Future+Electronics
R199 R225 = RC0402FR-0710KL: RES 10K OHM 1% 1/16W 0402; Manufacturer: Yageo; Max Power Dissipation: 63mW; Temperature Coefficient: 100ppm/°C; Resistance: 10kR; Voltage Rating (DC): 50V; Power Rating: 62.5mW; Item Type: Resistor; Manufacturer Part Number: RC0402FR-0710KL; RoHS: Yes; Category: Chip SMD Resistors; Case/Package: 0402; Case Code (Imperial): 0402; Case Code (Metric): 1005; Min Operating Temperature: -55°C; Max Operating Temperature: 155°C; Features: Moisture Resistant; Packaging: Tape and Reel; Tolerance: 1%; Number of Terminations: 2; Series: RC; RoHS Compliant: Yes; ComponentLink1URL: https://datasheet.ciiva.com/7660/38568-7660787.pdf?src-supplier=Element14; ComponentLink1Description: https://datasheet.ciiva.com/7660/38568-7660787.pdf?src-supplier=Element14; Supplier 1: Mouser; Stock 1: 18648329; Pricing 1: 1=0.10000, 10=0.01400, 50=0.01400, 100=0.00500, 1000=0.00300, 10000=0.00200 (USD); Number of Pins: 2; Resistor Type: Thick Film; Voltage Rating: 50V; Termination: SMD/SMT; Resistance Tolerance: 1%; Construction: Rectangular; Length: 1mm; Width: 0.5mm; Height: 0.32mm; Depth: 0.5mm; Lead Pitch: 0.2mm; REACH SVHC: No SVHC; Lead Free: Lead Free; Military Standard: Not; ComponentLink2URL: https://datasheet.ciiva.com/7849/1686128-7849814.pdf?src-supplier=Element14; ComponentLink2Description: https://datasheet.ciiva.com/7849/1686128-7849814.pdf?src-supplier=Element14; ComponentLink3URL: https://datasheet.ciiva.com/7983/1018594-7983486.pdf?src-supplier=Element14; ComponentLink3Description: https://datasheet.ciiva.com/7983/1018594-7983486.pdf?src-supplier=Element14; ComponentLink4URL: https://datasheet.ciiva.com/22747/1018594-22747512.pdf?src-supplier=Element14; ComponentLink4Description: https://datasheet.ciiva.com/22747/1018594-22747512.pdf?src-supplier=Element14; ComponentLink5URL: https://datasheet.ciiva.com/12667/pyu-rc0402-51-rohs-l-6-r-12667067.pdf?src-supplier=Mouser; ComponentLink5Description: https://datasheet.ciiva.com/12667/pyu-rc0402-51-rohs-l-6-r-12667067.pdf?src-supplier=Mouser; ComponentLink6URL: https://datasheet.ciiva.com/7849/1784430-7849813.pdf?src-supplier=Element14; ComponentLink6Description: https://datasheet.ciiva.com/7849/1784430-7849813.pdf?src-supplier=Element14; Supplier Part Number 1: 603-RC0402FR-0710KL; LCSC Part Number: C60490; Working Voltage: 50V; ComponentLink7URL: https://datasheet.ciiva.com/7849/1784430-7849815.pdf?src-supplier=Element14; ComponentLink7Description: https://datasheet.ciiva.com/7849/1784430-7849815.pdf?src-supplier=Element14
R226 = RC0402FR-071K5L: RES 1.5K OHM 1% 1/16W 0402; Manufacturer: Yageo; Resistance: 1.5kR; Power Rating: 62.5mW; Voltage Rating: 50V; Temperature Coefficient: 100ppm/°C; Max Power Dissipation: 63mW; Supplier 1: Digi-Key; Manufacturer Part Number: RC0402FR-071K5L; RoHS: Yes; Category: Chip SMD Resistors; Stock 1: 2832947; Pricing 1: 1=0.10000, 10=0.01500, 100=0.00610, 1000=0.00275, 2500=0.00239, 5000=0.00197 (USD); Case/Package: 0402; Case Code (Metric): 1005; Case Code (Imperial): 0402; Size Code: 0402; Min Operating Temperature: -55°C; Max Operating Temperature: 155°C; Resistor Type: Thick Film; Package Quantity: 1; Tolerance: 1%; Packaging: Tape and Reel; Number of Terminations: 2; Termination: SMD/SMT; Features: Moisture Resistant; Series: RC; Resistance Tolerance: 1%; Construction: Rectangular; Technology: THICK FILM; Length: 1mm; Width: 0.02inch; Height: 0.016inch; Depth: 0.5mm; RoHS Compliant: Yes; REACH SVHC: No SVHC; Military Standard: Not; Lead Free: Lead Free; ComponentLink1URL: https://datasheet.ciiva.com/11808/0900766b80c66297-11808238.pdf?src-supplier=RSComponents; ComponentLink1Description: https://datasheet.ciiva.com/11808/0900766b80c66297-11808238.pdf?src-supplier=RSComponents; ComponentLink2URL: https://datasheet.ciiva.com/46394/1018594-46394950.pdf?src-supplier=Element14; ComponentLink2Description: https://datasheet.ciiva.com/46394/1018594-46394950.pdf?src-supplier=Element14; ComponentLink3URL: https://datasheet.ciiva.com/2453/pyu-r-int-thick-7-2453440.pdf?src-supplier=Digi-Key; ComponentLink3Description: https://datasheet.ciiva.com/2453/pyu-r-int-thick-7-2453440.pdf?src-supplier=Digi-Key; ComponentLink4URL: https://datasheet.ciiva.com/2453/pyu-r-int-thick-7-2453441.pdf?src-supplier=Digi-Key; ComponentLink4Description: https://datasheet.ciiva.com/2453/pyu-r-int-thick-7-2453441.pdf?src-supplier=Digi-Key; ComponentLink5URL: https://datasheet.ciiva.com/2453/pyu-r-int-thick-7-2453439.pdf?src-supplier=Digi-Key; ComponentLink5Description: https://datasheet.ciiva.com/2453/pyu-r-int-thick-7-2453439.pdf?src-supplier=Digi-Key; ComponentLink6URL: https://datasheet.ciiva.com/12558/pyu-rc0402-51-rohs-l-6-r-8721-12558542.pdf?src-supplier=Mouser; ComponentLink6Description: https://datasheet.ciiva.com/12558/pyu-rc0402-51-rohs-l-6-r-8721-12558542.pdf?src-supplier=Mouser; ComponentLink7URL: https://datasheet.ciiva.com/7849/1018594-7849863.pdf?src-supplier=Element14; ComponentLink7Description: https://datasheet.ciiva.com/7849/1018594-7849863.pdf?src-supplier=Element14; ComponentLink8URL: https://datasheet.ciiva.com/7849/1018594-7849864.pdf?src-supplier=Element14; ComponentLink8Description: https://datasheet.ciiva.com/7849/1018594-7849864.pdf?src-supplier=Element14; ComponentLink9URL: https://datasheet.ciiva.com/15189/getdatasheetpartid-323992-15189370.pdf?src-supplier=Verical; ComponentLink9Description: https://datasheet.ciiva.com/15189/getdatasheetpartid-323992-15189370.pdf?src-supplier=Verical; Supplier Part Number 1: 311-1.50KLRCT-ND; LCSC Part Number: C114759
SW1-SW4 = TS-1185EC-C-D-B: 3mm 2mm Round Button 50mA Top3.65mm SPST 12V SMD Tactile Switches; Manufacturer: XKB; Manufacturer Part Number: TS-1185EC-C-D-B; Footprint: Custom; ComponentLink1Description: LCSC; ComponentLink1URL: https://lcsc.com/product-detail/Tactile-Switches_XKB-Connectivity-TS-1185EC-C-D-B_C318893.html; LCSC Part Number: C318893
U29 = PC817X2NIPW: Optoisolator Output Channel 4-SMD; Manufacturer: Sharp; Item Type: IC; Supplier: Mouser; Supplier Part Number: 852-PC817X2NIPW; Manufacturer Part Number: PC817X2NIPW; RoHS: No; Pricing: 1=0.54, 10=0.352, 50=0.352, 100=0.233, 1000=0.185, 10000=0.146 (USD); LCSC Part Number: C2840443